# Altium schematic sheet 2_FTDI.SchDoc
size A4; SheetNumber: 3; SheetTotal: 5
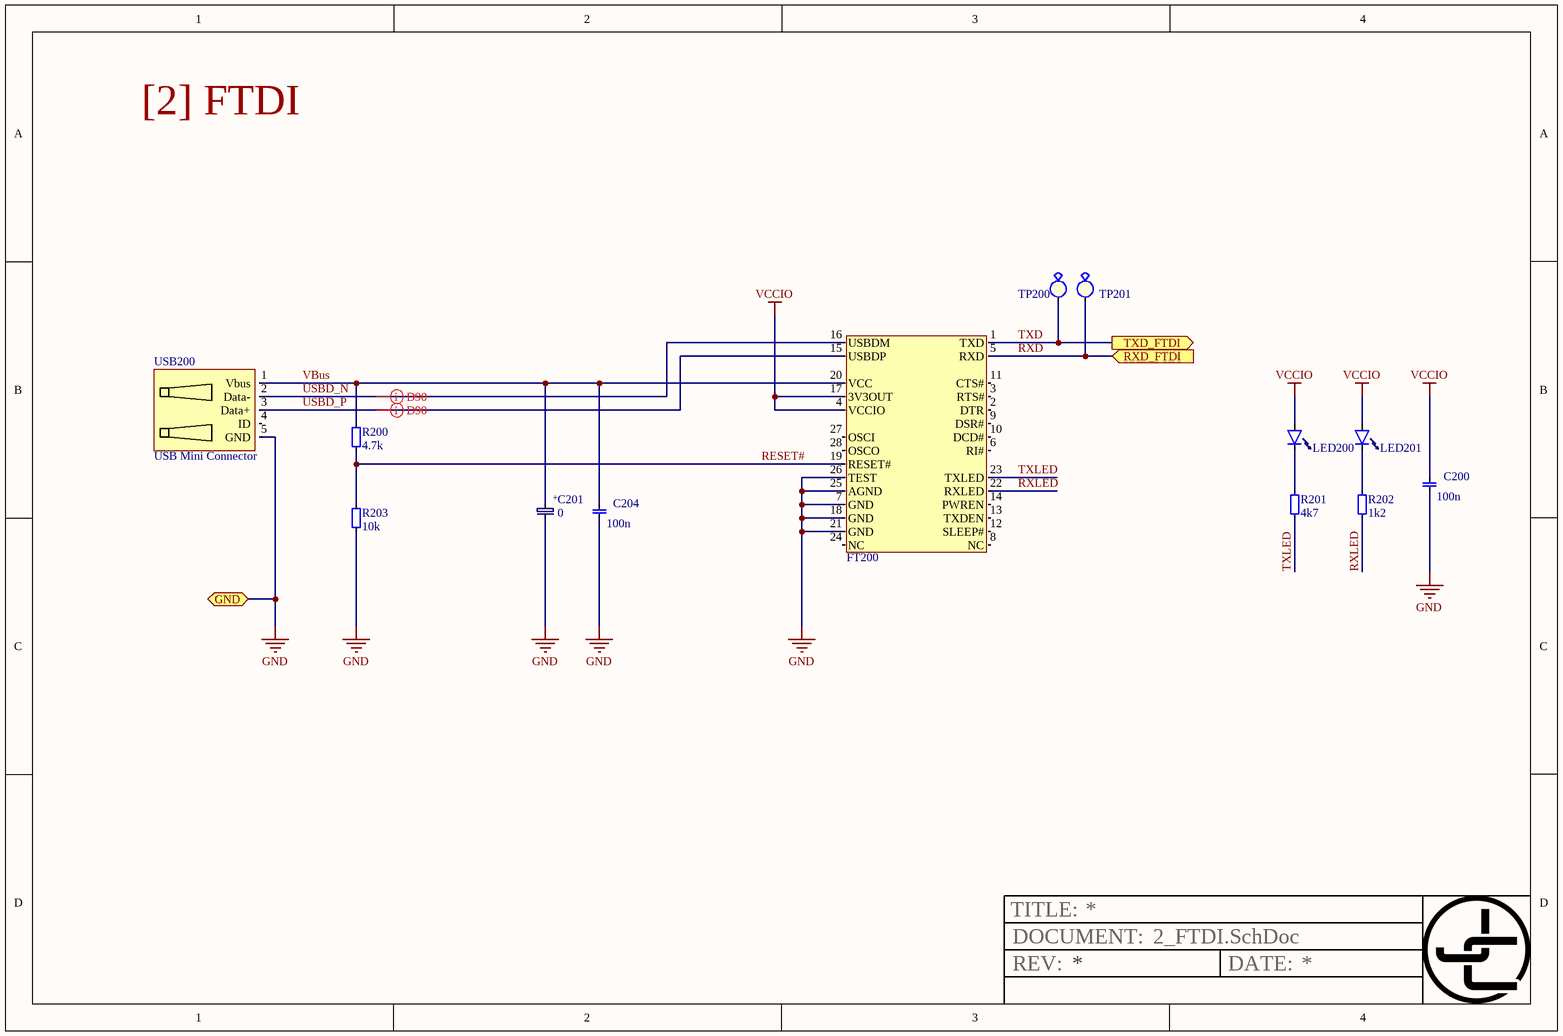
[diagram p0: 2_FTDI.SchDoc]

## Parts
C200  value 100n  [0603 cap]  (hidden comment: 0603, capacitor)
C201  value 0  [CASE_B]  (hidden comment: Cap, case B)
C204  value 100n  [0603 cap]  (hidden comment: 0603, capacitor)
FT200  FT232R  [SOP28]  (value not drawn)
LED200  0805, LED  [0805_led]  (value not drawn)
LED201  0805, LED  [0805_led]  (value not drawn)
R200  value 4.7k  [0603]  (hidden comment: 0603, resistor)
R201  value 4k7  [0603]  (hidden comment: 0603, resistor)
R202  value 1k2  [0603]  (hidden comment: 0603, resistor)
R203  value 10k  [0603]  (hidden comment: 0603, resistor)
TP200  Test Point  [testPoint]  (value not drawn)
TP201  Test Point  [testPoint]  (value not drawn)
USB200  USB Mini Connector  [USB Mini TH]

## Ports
GND (bidir), RXD_FTDI (in), TXD_FTDI (out)

## Nets
GND: C200.0 C201.1 C204.0 FT200.7(GND) FT200.18(GND) FT200.21(GND) FT200.25(AGND) FT200.26(TEST) R203.1 USB200.5(GND) ; port GND
VCCIO: C200.1 FT200.4(VCCIO) FT200.17(3V3OUT) LED200.1 LED201.1
RESET#: FT200.19(RESET#) R200.1 R203.0
RXD: FT200.5(RXD) TP201.0 ; port RXD_FTDI
RXLED: FT200.22(RXLED) R202.1
TXD: FT200.1(TXD) TP200.0 ; port TXD_FTDI
TXLED: FT200.23(TXLED) R201.1
USBD_N: FT200.16(USBDM) USB200.2(Data-)
USBD_P: FT200.15(USBDP) USB200.3(Data+)
VBus: C201.2 C204.1 FT200.20(VCC) R200.0 USB200.1(Vbus)
NetLED200_0: LED200.0(Cathode) R201.0
NetLED201_0: LED201.0(Cathode) R202.0

Not connected (* = marked no-connect by the designer): FT200 2(DTR) 3(RTS#) 6(RI#) 8(NC) 9(DSR#) 10(DCD#) 11(CTS#) 12(SLEEP#) 13(TXDEN) 14(PWREN) 24(NC) 27(OSCI) 28(OSCO); USB200 4(ID)

## Layout directives
differential pair; differential pair class USB2.0: USBD_N, USBD_P

## Notes on the sheet
- [2] FTDI
- TITLE:
- REV:
- DOCUMENT:
- DATE:
- (in symbol Cap, case B) +

## Library data of the parts
FT200 = FT232R: USB UART IC; Value: FT232R; DigiKey: 768-1007-1-ND; Farnell: 1146032
LED200 LED201 = 0805, LED: Value: 0805 LED
C200 C204 = 0603, capacitor: Order number: *
TP200 TP201 = Test Point: Value: Test point; Farnell: 1702006
USB200 = USB Mini Connector: Value: USB Mini Connector; Farnell: 1125348